# EAGLE design 7SEGBIG (EAGLE 7.2.0)
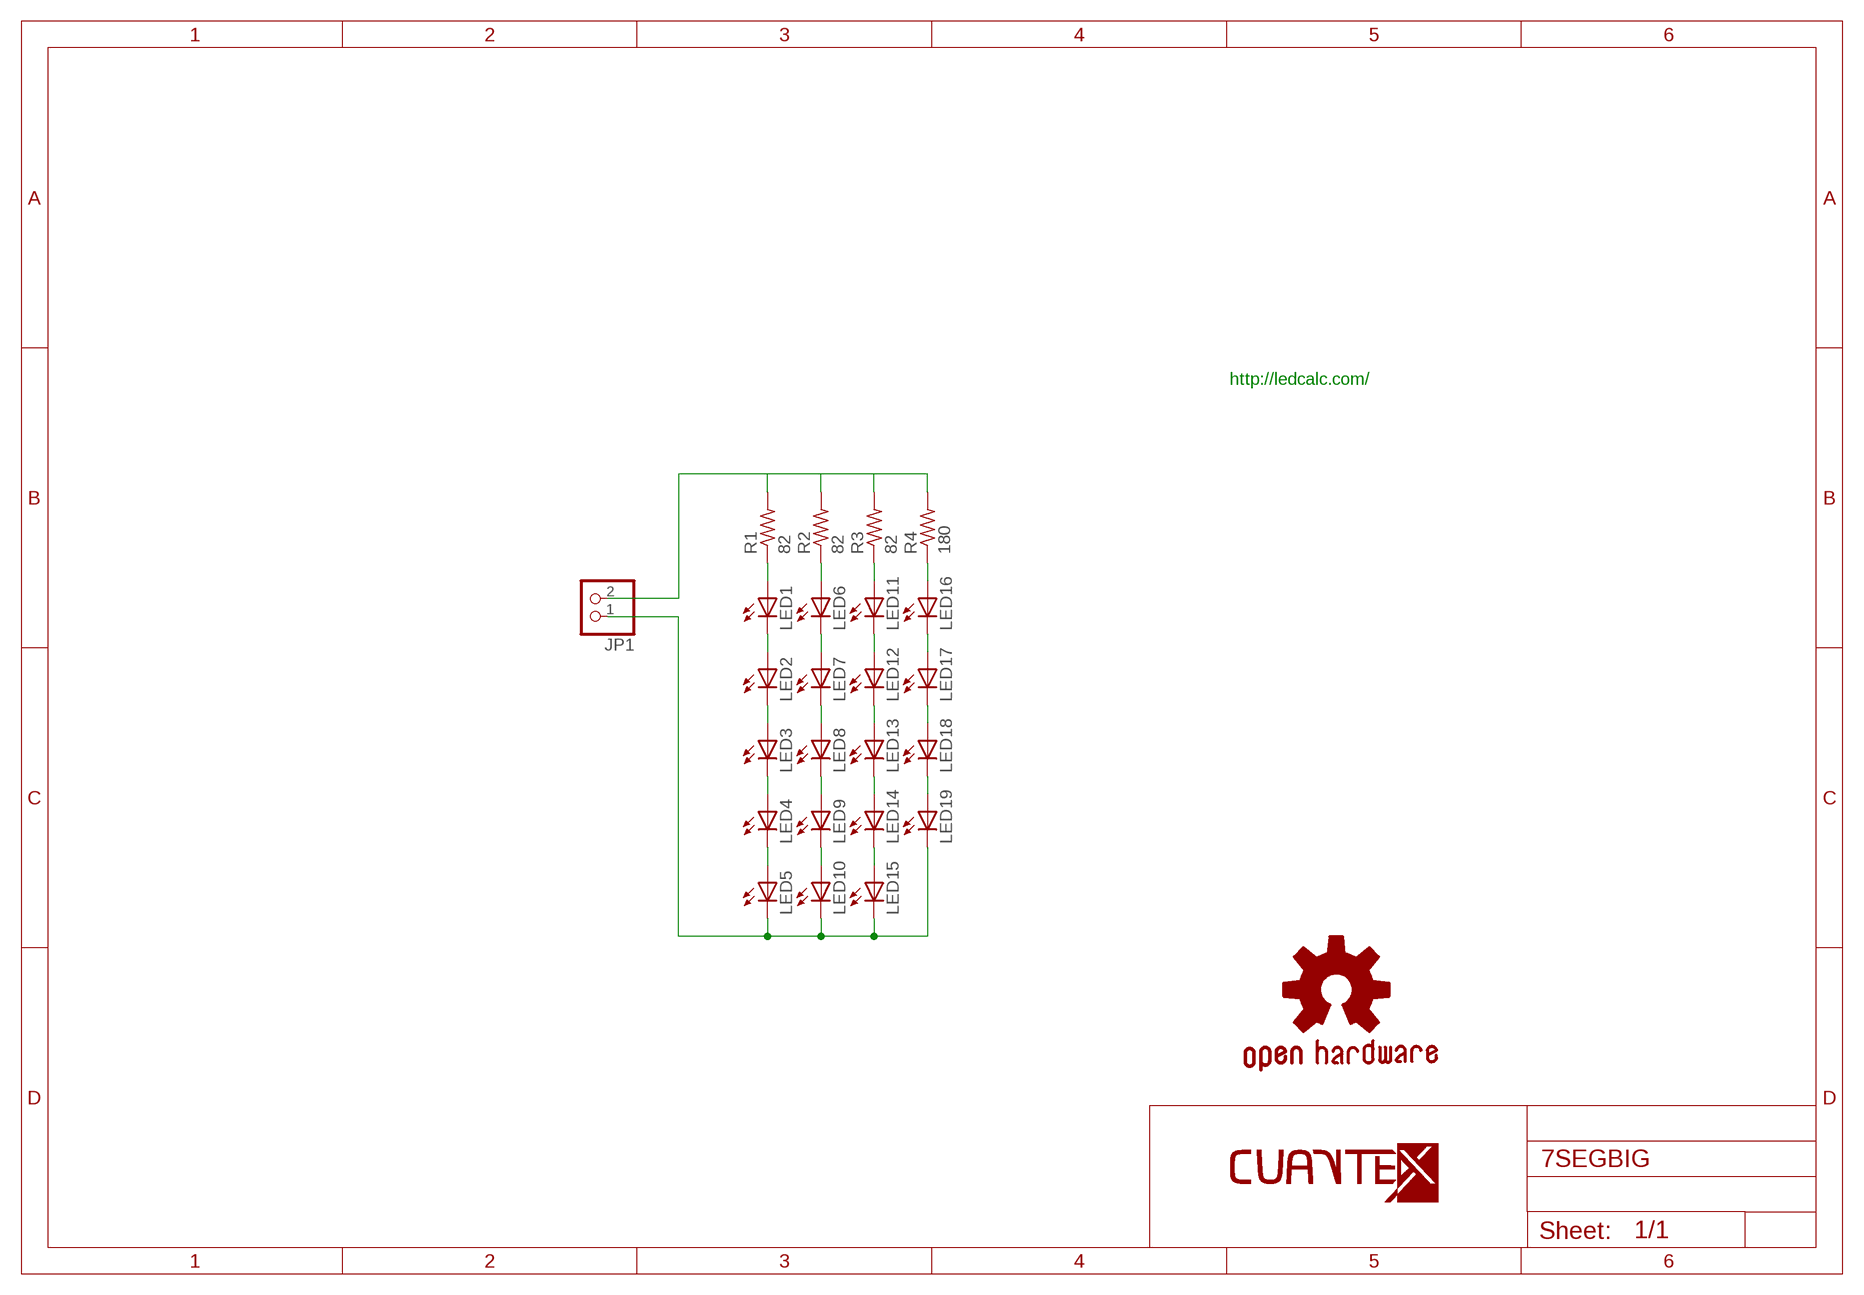
[diagram p0: schematic, sheet 1]

## Parts
GOLD_ORB_SM1  OSHWLOGO_GOLD_ORB_LG  [OSHW0]
JP1  PINHD-1X2/90  [1X02/90]
LED1  LEDKA-3528ASYC  [KA-3528ASYC]
LED2  LEDKA-3528ASYC  [KA-3528ASYC]
LED3  LEDKA-3528ASYC  [KA-3528ASYC]
LED4  LEDKA-3528ASYC  [KA-3528ASYC]
LED5  LEDKA-3528ASYC  [KA-3528ASYC]
LED6  LEDKA-3528ASYC  [KA-3528ASYC]
LED7  LEDKA-3528ASYC  [KA-3528ASYC]
LED8  LEDKA-3528ASYC  [KA-3528ASYC]
LED9  LEDKA-3528ASYC  [KA-3528ASYC]
LED10  LEDKA-3528ASYC  [KA-3528ASYC]
LED11  LEDKA-3528ASYC  [KA-3528ASYC]
LED12  LEDKA-3528ASYC  [KA-3528ASYC]
LED13  LEDKA-3528ASYC  [KA-3528ASYC]
LED14  LEDKA-3528ASYC  [KA-3528ASYC]
LED15  LEDKA-3528ASYC  [KA-3528ASYC]
LED16  LEDKA-3528ASYC  [KA-3528ASYC]
LED17  LEDKA-3528ASYC  [KA-3528ASYC]
LED18  LEDKA-3528ASYC  [KA-3528ASYC]
LED19  LEDKA-3528ASYC  [KA-3528ASYC]
R1  82  R-US_R1206  [R1206]
R2  82  R-US_R1206  [R1206]
R3  82  R-US_R1206  [R1206]
R4  180  R-US_R1206  [R1206]
U$3  LOGO-TOP-10MM  [C-000]

## Nets
GND: JP1.1 LED5.C LED10.C LED15.C LED19.C
N$2: LED1.A R1.1
N$3: LED6.A R2.1
N$4: LED11.A R3.1
N$5: LED16.A R4.1
N$6: LED16.C LED17.A
N$7: LED11.C LED12.A
N$8: LED6.C LED7.A
N$9: LED1.C LED2.A
N$10: LED2.C LED3.A
N$11: LED7.C LED8.A
N$12: LED12.C LED13.A
N$13: LED17.C LED18.A
N$14: LED18.C LED19.A
N$15: LED13.C LED14.A
N$16: LED8.C LED9.A
N$17: LED3.C LED4.A
N$18: LED14.C LED15.A
N$19: LED9.C LED10.A
N$20: LED4.C LED5.A
N$21: JP1.2 R1.2 R2.2 R3.2 R4.2

## Notes on the sheet
- http://ledcalc.com/

## Library data of the parts
GOLD_ORB_SM1 = OPENHW:OSHWLOGO: These are Open-Source Hardware logos.
JP1 = pinhead:PINHD-1X2: PIN HEADER
LED1-LED19 = led:LED: LED OSRAM: - CHIPLED LG R971, LG N971, LY N971, LG Q971, LY Q971, LO R971, LY R971 LH N974, LH R974 LS Q976, LO Q976, LY Q976 LO Q996 - Hyper CHIPLED LW Q18S LB Q993, LB Q99A, LB R99A - SideLED LS A670, LO A670, LY A670, LG A670, LP A670 LB A673, LV A673, LT A673, LW A673 LH A674 LY A675 LS A676, LA A676, LO A676, LY A676, LW A676 LS A679, LY A679, LG A679 - Hyper Micro SIDELED® LS Y876, LA Y876, LO Y876, LY Y876 LT Y87S - SmartLED LW L88C, LW L88S LB L89C, LB L89S, LG L890 LS L89K, LO L89K, LY L89K LS L896, LA L896, LO L896, LY L896 - TOPLED LS T670, LO T670, LY T670, LG T670, LP T670 LSG T670, LSP T670, LSY T670, LOP T670, LYG T670 LG T671, LOG T671, LSG T671 LB T673, LV T673, LT T673, LW T673 LH T674 LS T676, LA T676, LO T676, LY T676, LB T676, LH T676, LSB T676, LW T676 LB T67C, LV T67C, LT T67C, LS T67K, LO T67K, LY T67K, LW E67C LS E67B, LA E67B, LO E67B, LY E67B, LB E67C, LV E67C, LT E67C LW T67C LS T679, LY T679, LG T679 LS T770, LO T770, LY T770, LG T770, LP T770 LB T773, LV T773, LT T773, LW T773 LH T774 LS E675, LA E675, LY E675, LS T675 LS T776, LA T776, LO T776, LY T776, LB T776 LHGB T686 LT T68C, LB T68C - Hyper Mini TOPLED® LB M676 - Mini TOPLED Santana® LG M470 LS M47K, LO M47K, LY M47K Source: http://www.osram.convergy.de LUXEON: - LUMILED® LXK2-PW12-R00, LXK2-PW12-S00, LXK2-PW14-U00, LXK2-PW14-V00 LXK2-PM12-R00, LXK2-PM12-S00, LXK2-PM14-U00 LXK2-PE12-Q00, LXK2-PE12-R00, LXK2-PE12-S00, LXK2-PE14-T00, LXK2-PE14-U00 LXK2-PB12-K00, LXK2-PB12-L00, LXK2-PB12-M00, LXK2-PB14-N00, LXK2-PB14-P00, LXK2-PB14-Q00 LXK2-PR12-L00, LXK2-PR12-M00, LXK2-PR14-Q00, LXK2-PR14-R00 LXK2-PD12-Q00, LXK2-PD12-R00, LXK2-PD12-S00 LXK2-PH12-R00, LXK2-PH12-S00 LXK2-PL12-P00, LXK2-PL12-Q00, LXK2-PL12-R00 Source: www.luxeon.com KINGBRIGHT: KA-3528ASYC Source: www.kingbright.com
R1-R4 = rcl:R-US_: RESISTOR, American symbol
U$3 = LOGOTIPOS:LOGO-TOP-10MM

## Board
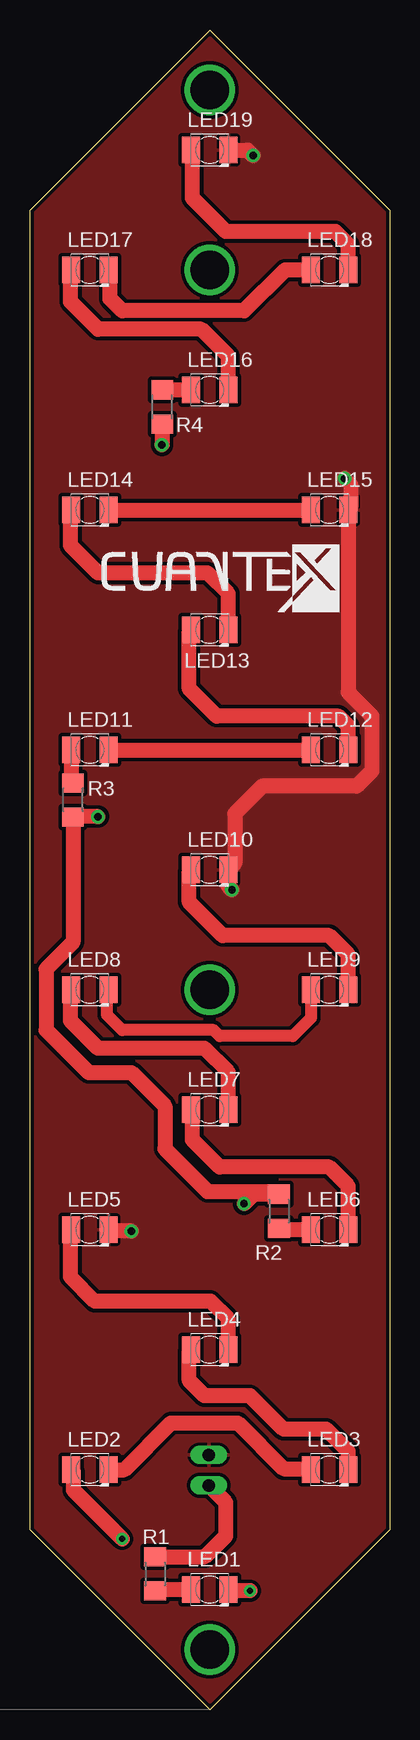
[diagram p1: board, top side]
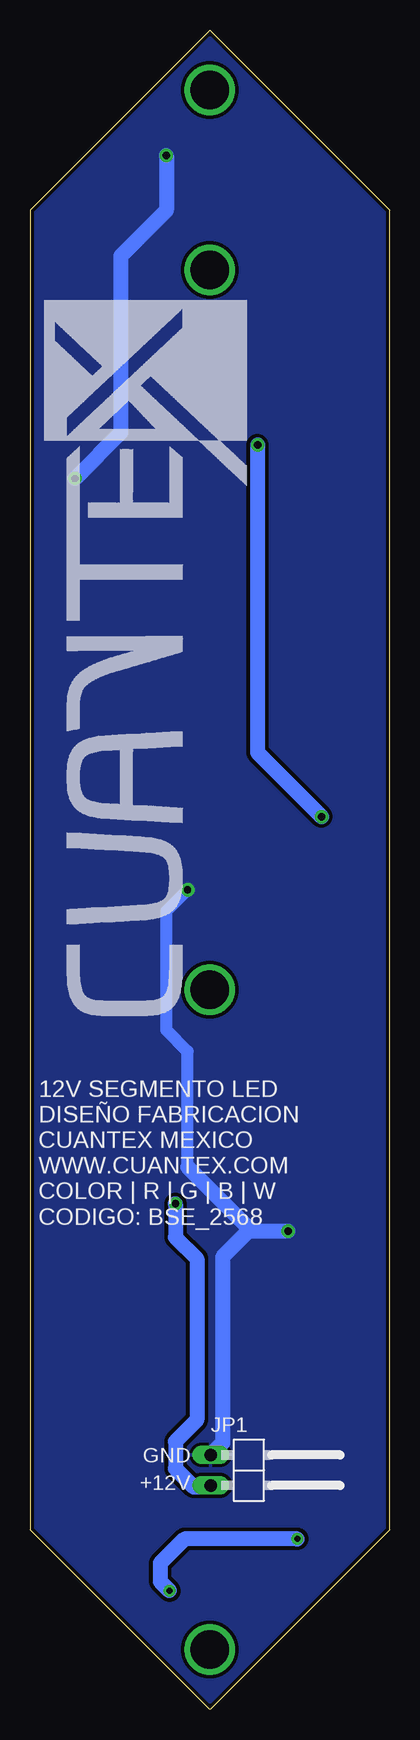
[diagram p2: board, bottom side, seen from below]

Size 30 x 140 mm. Coordinates in mm from the lower left corner, seen from the top.
Outline: 0,15 0,125 15,140 30,125 30,15 15,0 0,15
Copper layers (1*16): Top 0.035mm / dielectric 1.5mm / Bottom 0.035mm
Design rules "cuantex2layerdrc3-7mil": minimum track width 8mil, minimum drill 0.3mm, track to track 7mil, track to pad 7mil, pad to pad 7mil, via to via 7mil, smd to smd 0mil, copper to edge 10mil, drill to drill 10mil, minimum pad ring 10mil, minimum via ring 10mil, stop-mask expansion 4mil, vias tented up to drill 0mil, thermal gap 10mil

### Footprints (pad centres in the part's own frame; a part is rotated, then mirrored left to right if it is on the bottom)
1X02/90 = drill 1.016 long: 1 -1.27,-3.81; 2 1.27,-3.81
KA-3528ASYC = smd 1.5 x 2.2: A -1.55,0; C 1.55,0
R1206 = smd 1.6 x 1.803: 1 -1.422,0; 2 1.422,0

### Placement (x,y rotation side)
GOLD_ORB_SM1  -19.99,-35.31 0 top  (outside the outline)
JP1  11.11,19.94 270 bottom
LED1  15,10 0 top
LED2  5,20 0 top
LED3  25,20 0 top
LED4  15,30 0 top
LED5  5,40 0 top
LED6  25,40 0 top
LED7  15,50 0 top
LED8  5,60 0 top
LED9  25,60 0 top
LED10  15,70 0 top
LED11  5,80 0 top
LED12  25,80 0 top
LED13  15,90 0 top
LED14  5,100 0 top
LED15  25,100 0 top
LED16  15,110 0 top
LED17  5,120 0 top
LED18  25,120 0 top
LED19  15,130 0 top
R1  10.44,11.31 90 top
R2  20.78,41.53 90 top
R3  3.59,75.81 270 top
R4  11.04,108.58 270 top
U$1  [C-0]  5.92,91.44 0 top
U$2  [C-4]  11.76,57.66 90 bottom
U$3  8.97,-24.38 0 top  (outside the outline)

### Tracks (layer width: path | path; a pad name or v marks a point on that pad's centre or on a via)
GND  (via drill 0.6)
  Top 1.27: LED19.C 18.16,130 v18.62,129.54 | v26.24,102.62 26.75,102.11 26.75,100.2 LED15.C 26.55,84.78 28.53,82.8 28.53,78.23 27.26,76.96 19.38,76.96 17.1,74.68 17.1,70.55 LED10.C 16.55,68.62 v16.84,68.33 | v8.46,39.88 6.67,39.88 LED5.C
  Bottom 1.016: 16.84,45.21 16.84,54.86 18.62,56.64 18.62,66.55 v16.84,68.33
  Bottom 1.27: v18.62,129.54 18.62,124.97 22.43,121.16 22.43,106.43 v26.24,102.62 | 16.84,45.21 11.64,40.01 | 11.64,40.01 11.51,39.88 v8.46,39.88 | 11.64,40.01 13.92,37.72 13.92,22.22 JP1.1
  pour Top (isolate 0.305): 15,140 30,125 30,15 15,0 0,15 0,125
  pour Bottom (isolate 0.305): 15,140 30,125 30,15 15,0 0,15 0,125
N$1  (via drill 3.2)
  other vias: 15,135
N$2
  Top 1.27: LED1.A 10.44,10 R1.1
N$3
  Top 1.27: LED6.A 20.89,40 R2.1
N$4
  Top 1.27: LED11.A 3.45,77.38 R3.1
N$5
  Top 1.27: LED16.A R4.1
N$6
  Top 1.27: LED16.C 16.55,112.82 14.3,115.06 5.67,115.06 3.38,117.35 3.38,119.93 LED17.A
N$7
  Top 1.27: LED11.C LED12.A
N$8
  Top 1.27: LED6.C 26.55,43.63 24.97,45.21 15.83,45.21 13.54,47.5 13.54,49.91 LED7.A
N$9  (via drill 0.5)
  Top 1.27: v7.7,14.22 3.64,18.29 3.64,19.81 LED2.A | v18.37,9.91 16.64,9.91 LED1.C
  Bottom 1.27: v7.7,14.22 17.1,14.22 19.13,12.19 19.13,10.67 v18.37,9.91
N$10
  Top 1.27: LED2.C 7.89,20 11.76,23.88 17.35,23.88 21.16,20.07 23.38,20.07 LED3.A
N$11
  Top 1.27: LED7.C 16.55,53.13 14.56,55.12 5.67,55.12 3.38,57.4 3.38,59.93 LED8.A
N$12
  Top 1.27: LED12.C 26.55,81.99 25.73,82.8 15.57,82.8 13.29,85.09 13.29,89.84 LED13.A
N$13
  Top 1.27: LED18.A 21.27,120 17.86,116.59 7.7,116.59 6.68,117.6 6.68,119.87 LED17.C
N$14
  Top 1.27: LED18.C 26.55,122.12 25.48,123.19 16.34,123.19 13.54,125.98 13.54,129.91 LED19.A
N$15
  Top 1.27: LED13.C 16.55,93 14.81,94.74 5.67,94.74 3.38,97.03 3.38,99.93 LED14.A
N$16
  Top 1.016: LED9.A 23.45,57.66 21.92,56.13 15.83,56.13 15.32,56.64 7.7,56.64 6.43,57.91 6.43,59.88 LED8.C
N$17
  Top 1.27: LED3.C 26.55,21.54 24.72,23.37 21.16,23.37 18.37,26.16 14.56,26.16 13.29,27.43 13.29,29.84 LED4.A
N$18
  Top 1.27: LED14.C LED15.A
N$19
  Top 1.27: LED9.C 26.55,62.94 24.97,64.52 16.08,64.52 13.29,67.31 13.29,69.84 LED10.A
N$20
  Top 1.27: LED4.C 16.55,32.55 15.07,34.04 5.41,34.04 3.38,36.07 3.38,39.93 LED5.A
N$21  (via drill 0.6)
  Top 1.27: R1.2 14.59,12.73 16.34,14.48 16.34,17.26 JP1.2 | R4.2 11.04,105.45 v11,105.41 | v5.67,74.42 3.62,74.42 R3.2 3.59,63.97 1.35,61.72 1.35,56.64 4.91,53.09 8.46,53.09 11.26,50.29 11.26,46.74 14.81,43.18 20.55,43.18 R2.2 18.65,42.96 v17.86,42.16
  Bottom 1.27: v11,105.41 11,79.76 v5.67,74.42 | v17.86,42.16 17.86,39.37 16.08,37.59 16.08,24.13 17.86,22.35 17.86,20.07 16.34,18.54 15.05,18.54 JP1.2
N$22  (via drill 3.2)
  other vias: 15,5
N$23  (via drill 3.2)
  other vias: 15,120
N$24  (via drill 3.2)
  other vias: 15,60

### Text on the board
bPlace: 12V SEGMENTO LED / DISEÑO FABRICACION / CUANTEX MEXICO / WWW.CUANTEX.COM / COLOR | R | G | B | W / CODIGO: BSE_2568 | GND | +12V